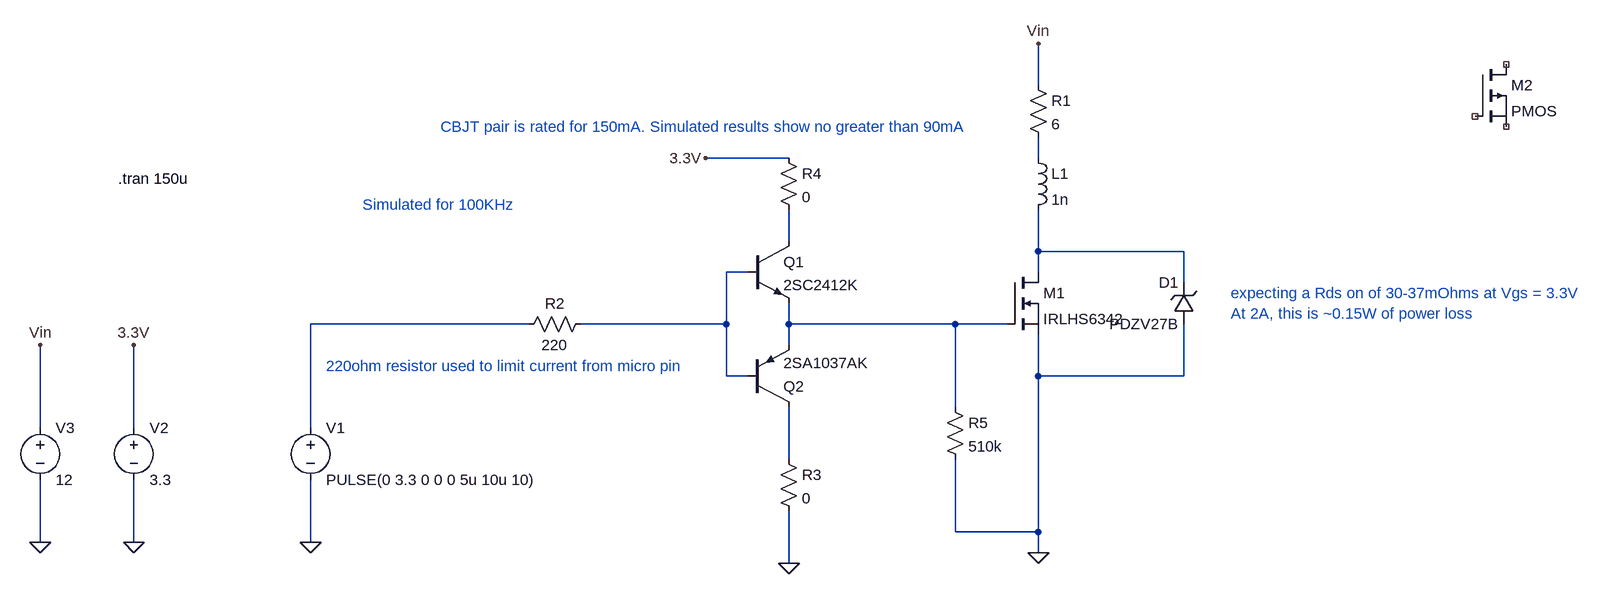
[diagram p0: schematic gate_driver.asc]
gate_driver.asc, the LTspice schematic file:
Version 4
SHEET 1 1692 680
WIRE 624 -240 624 -304
WIRE 240 -128 112 -128
WIRE 624 -128 624 -160
WIRE 240 0 240 -48
WIRE 624 16 624 -48
WIRE 848 16 624 16
WIRE 176 48 144 48
WIRE 624 48 624 16
WIRE 848 64 848 16
WIRE -160 128 -496 128
WIRE 144 128 144 48
WIRE 144 128 -80 128
WIRE 240 128 240 96
WIRE 496 128 240 128
WIRE 576 128 496 128
WIRE 240 160 240 128
WIRE 144 208 144 128
WIRE 176 208 144 208
WIRE 624 208 624 144
WIRE 848 208 848 128
WIRE 848 208 624 208
WIRE 496 256 496 128
WIRE -912 288 -912 160
WIRE -768 288 -768 160
WIRE -496 288 -496 128
WIRE 240 336 240 256
WIRE 496 448 496 336
WIRE 624 448 624 208
WIRE 624 448 496 448
WIRE -912 464 -912 368
WIRE -768 464 -768 368
WIRE -496 464 -496 368
WIRE 624 480 624 448
WIRE 240 496 240 416
FLAG 624 480 0
FLAG 240 496 0
FLAG -912 464 0
FLAG -768 464 0
FLAG -496 464 0
FLAG -912 160 Vin
FLAG -768 160 3.3V
FLAG 624 -304 Vin
FLAG 112 -128 3.3V
SYMBOL npn 176 0 R0
SYMATTR InstName Q1
SYMATTR Value 2SC2412K
SYMBOL pnp 176 256 M180
SYMATTR InstName Q2
SYMATTR Value 2SA1037AK
SYMBOL voltage -496 272 R0
WINDOW 123 0 0 Left 0
WINDOW 39 0 0 Left 0
SYMATTR InstName V1
SYMATTR Value PULSE(0 3.3 0 0 0 5u 10u 10)
SYMBOL voltage -768 272 R0
WINDOW 123 0 0 Left 0
WINDOW 39 0 0 Left 0
SYMATTR InstName V2
SYMATTR Value 3.3
SYMBOL voltage -912 272 R0
WINDOW 123 0 0 Left 0
WINDOW 39 0 0 Left 0
SYMATTR InstName V3
SYMATTR Value 12
SYMBOL res 608 -256 R0
SYMATTR InstName R1
SYMATTR Value 6
SYMBOL nmos 576 48 R0
SYMATTR InstName M1
SYMATTR Value IRLHS6342
SYMBOL res -64 112 R90
WINDOW 0 0 56 VBottom 2
WINDOW 3 32 56 VTop 2
SYMATTR InstName R2
SYMATTR Value 220
SYMBOL res 224 -144 R0
SYMATTR InstName R4
SYMATTR Value 0
SYMBOL res 224 320 R0
SYMATTR InstName R3
SYMATTR Value 0
SYMBOL ind 608 -144 R0
SYMATTR InstName L1
SYMATTR Value 1n
SYMBOL res 480 240 R0
SYMATTR InstName R5
SYMATTR Value 510k
SYMBOL zener 864 128 R180
WINDOW 0 24 64 Left 2
WINDOW 3 24 0 Left 2
SYMATTR InstName D1
SYMATTR Value PDZV27B
SYMBOL pmos 1296 -272 R0
SYMATTR InstName M2
TEXT -792 -96 Left 2 !.tran 150u
TEXT -416 -56 Left 2 ;Simulated for 100KHz
TEXT -296 -176 Left 2 ;CBJT pair is rated for 150mA. Simulated results show no greater than 90mA
TEXT -472 192 Left 2 ;220ohm resistor used to limit current from micro pin
TEXT 920 80 Left 2 ;expecting a Rds on of 30-37mOhms at Vgs = 3.3V\nAt 2A, this is ~0.15W of power loss

The netlist it stands for:
* gate_driver.asc
Q1 N002 N004 N006 0 2SC2412K
Q2 N007 N004 N006 0 2SA1037AK
V1 N005 0 PULSE(0 3.3 0 0 0 5u 10u 10)
V2 3.3V 0 3.3
V3 Vin 0 12
R1 Vin N001 6
M1 N003 N006 0 0 IRLHS6342
R2 N004 N005 220
R4 3.3V N002 0
R3 N007 0 0
L1 N001 N003 1n
R5 N006 0 510k
D1 0 N003 PDZV27B
M2 NC_01 NC_02 NC_03 NC_03 PMOS
.model D D
.lib standard.dio
.model NPN NPN
.model PNP PNP
.lib standard.bjt
.model NMOS NMOS
.model PMOS PMOS
.lib standard.mos
.tran 150u
* Simulated for 100KHz
* CBJT pair is rated for 150mA. Simulated results show no greater than 90mA
* 220ohm resistor used to limit current from micro pin
* expecting a Rds on of 30-37mOhms at Vgs = 3.3V
* At 2A, this is ~0.15W of power loss
.backanno
.end